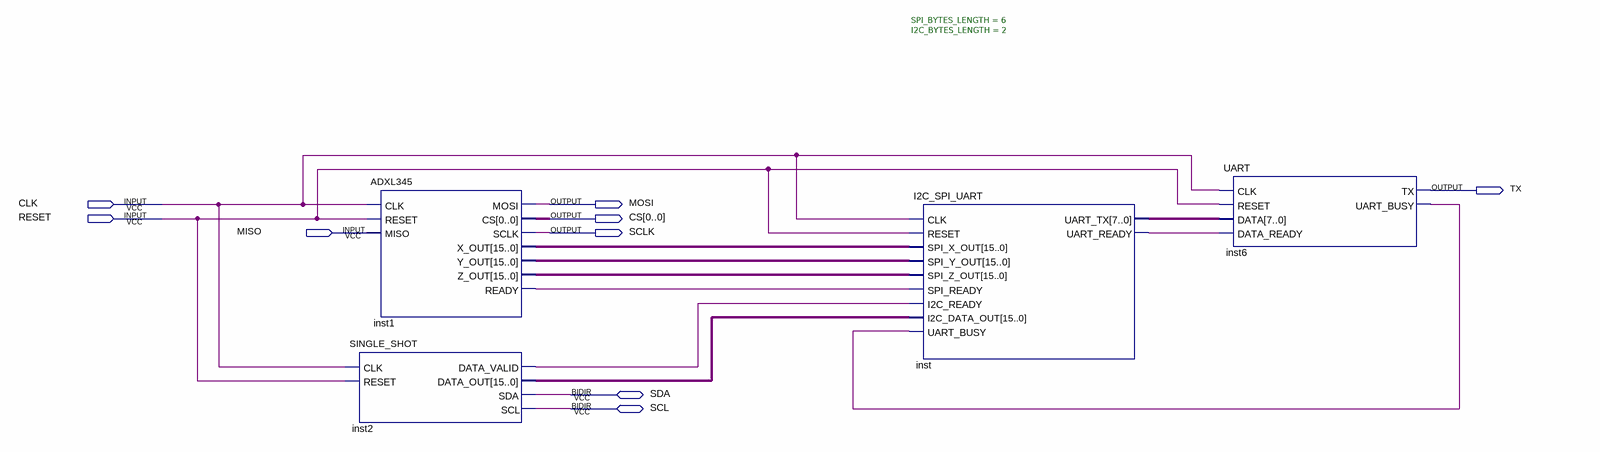
[diagram p0: schematic sheet]
// Quartus schematic I2C_SPI_UART_BLOCK.bdf as structural Verilog: 4 symbols, 9 pins
module I2C_SPI_UART_BLOCK (
  input  CLK,
  input  RESET,
  input  MISO,
  inout  SDA,
  inout  SCL,
  output TX,
  output MOSI,
  output [0:0] CS,
  output SCLK
);

  wire inst1_ready, inst2_data_valid, inst6_uart_busy, inst_uart_ready;
  wire [7:0] inst_uart_tx;
  wire [15:0] inst1_x_out, inst1_y_out, inst1_z_out, inst2_data_out;

  ADXL345 inst1 (
    .CLK(CLK), .RESET(RESET), .MISO(MISO), .MOSI(MOSI), .CS(CS[0]), .SCLK(SCLK), .X_OUT(inst1_x_out),
    .Y_OUT(inst1_y_out), .Z_OUT(inst1_z_out), .READY(inst1_ready));
  SINGLE_SHOT inst2 (
    .CLK(CLK), .RESET(RESET), .DATA_VALID(inst2_data_valid), .DATA_OUT(inst2_data_out), .SDA(SDA), .SCL(SCL));
  I2C_SPI_UART #(.SPI_BYTES_LENGTH(6), .I2C_BYTES_LENGTH(2)) inst (
    .CLK(CLK), .RESET(RESET), .SPI_X_OUT(inst1_x_out), .SPI_Y_OUT(inst1_y_out), .SPI_Z_OUT(inst1_z_out),
    .SPI_READY(inst1_ready), .I2C_READY(inst2_data_valid), .I2C_DATA_OUT(inst2_data_out),
    .UART_BUSY(inst6_uart_busy), .UART_TX(inst_uart_tx), .UART_READY(inst_uart_ready));
  UART inst6 (
    .CLK(CLK), .RESET(RESET), .DATA(inst_uart_tx), .DATA_READY(inst_uart_ready), .TX(TX),
    .UART_BUSY(inst6_uart_busy));
endmodule
